# Altium project DrumPad.PrjPcb
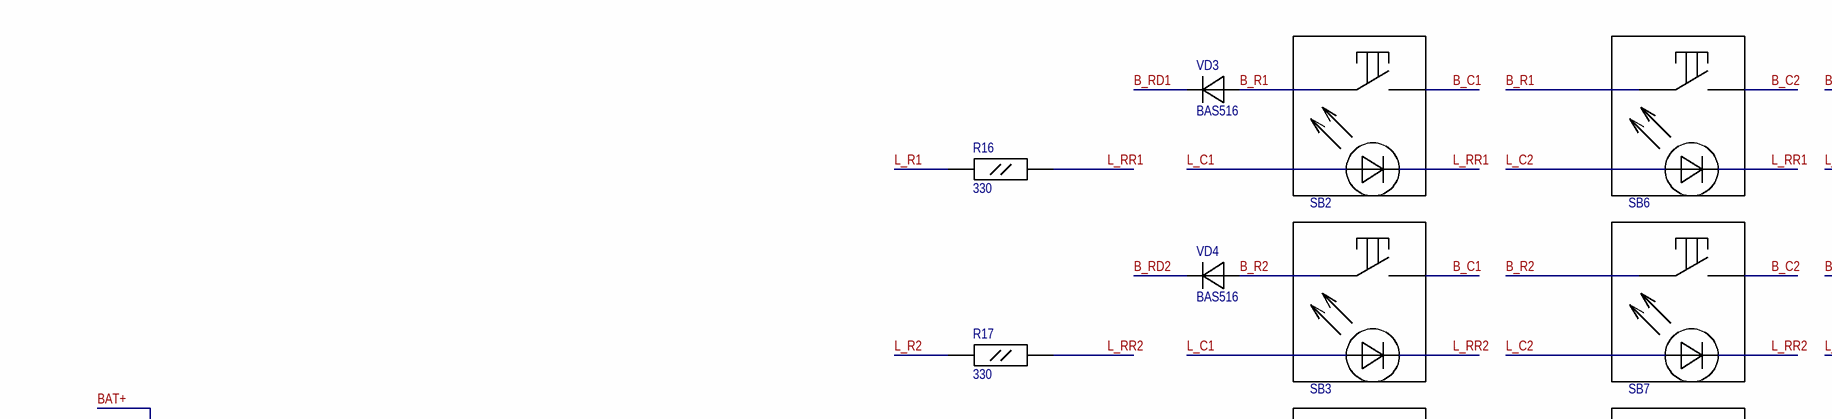
[diagram p0: DrumPad.SchDoc, top left]
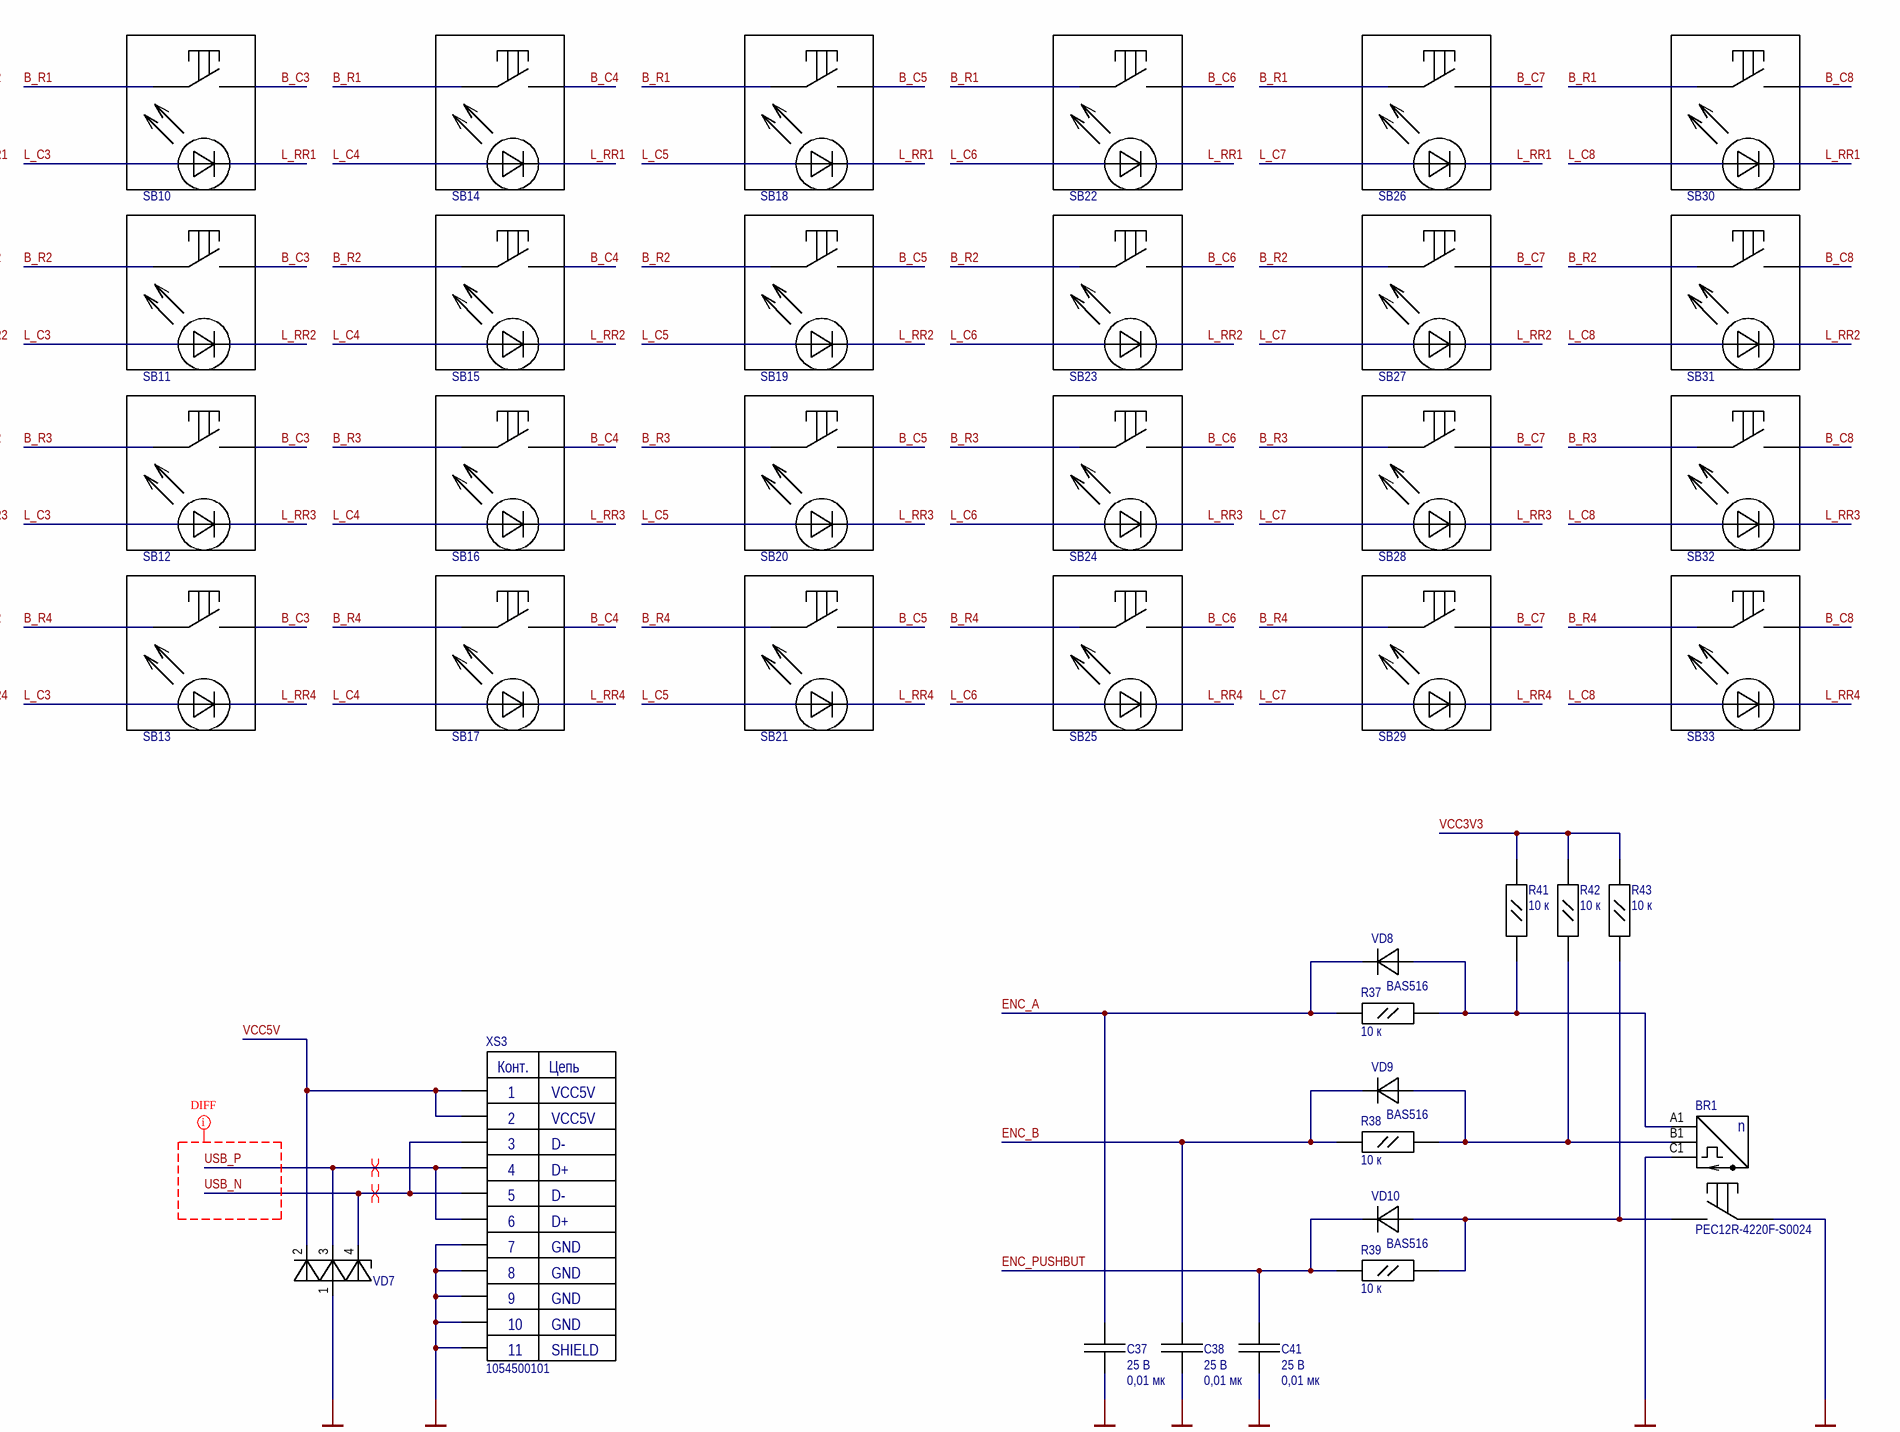
[diagram p1: DrumPad.SchDoc, top right]
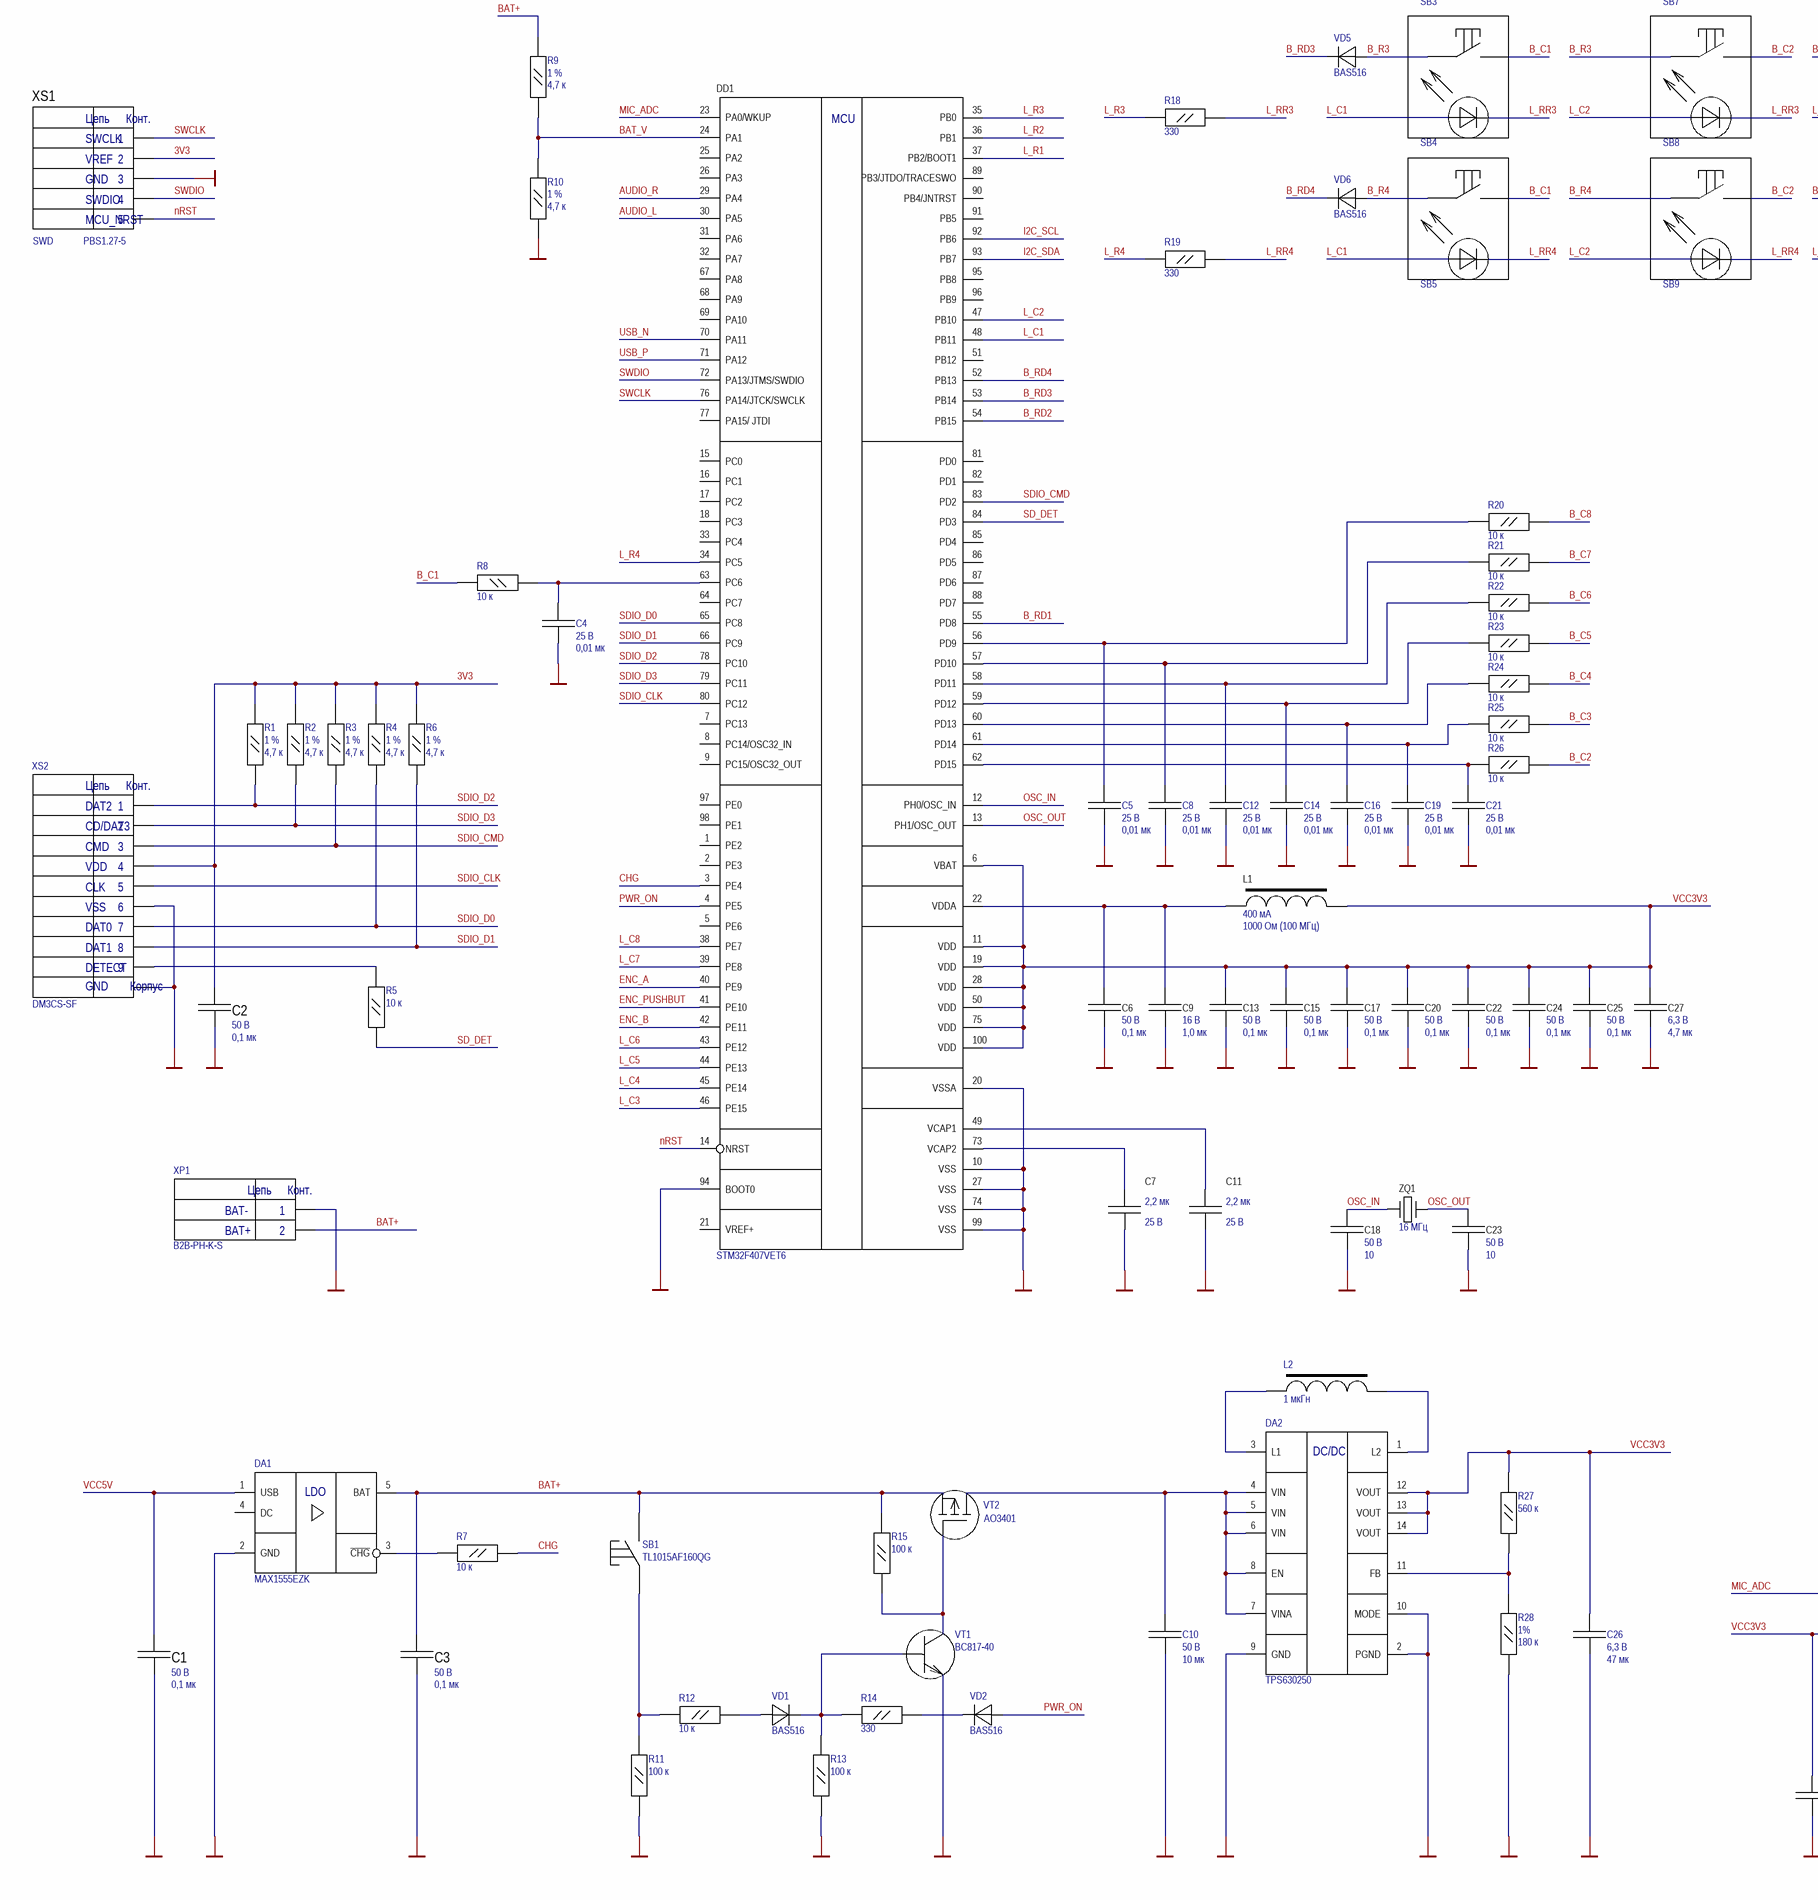
[diagram p2: DrumPad.SchDoc, bottom left]
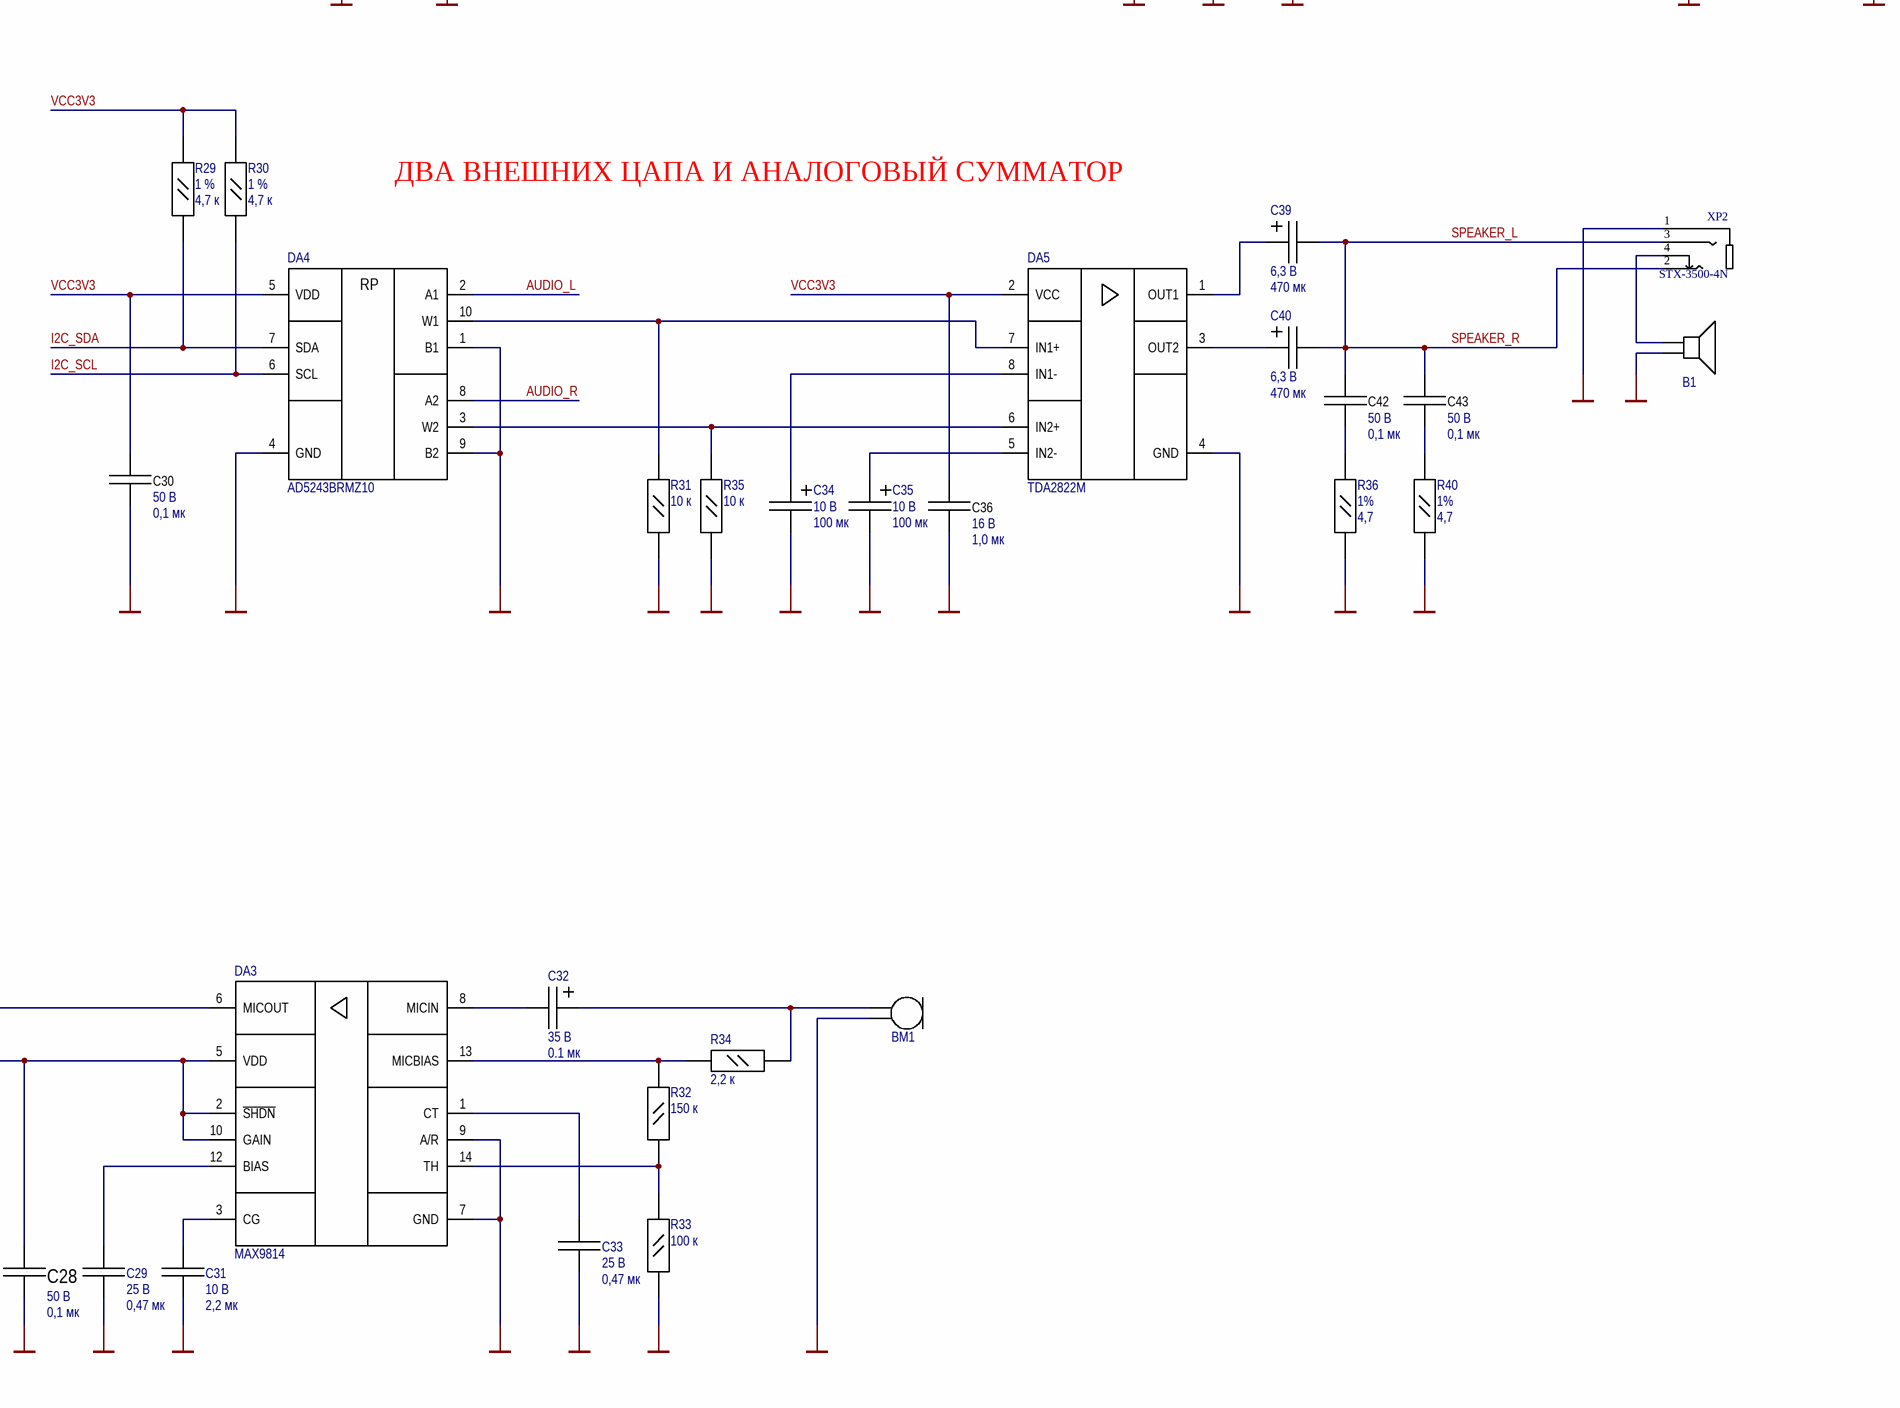
[diagram p3: DrumPad.SchDoc, bottom right]
Document Number: DP.01; DocumentNumber: DP.01; Name: ДАНЯ; Title doc: Drum Pad; Проверил: Никто(; Разработал: Я; Утвердил: Никто(
1 sheet, 148 parts. Net scope: global (net labels, ports and power ports of the same name join across sheets).
Board file: DrumPad.PcbDoc

## Sheet DrumPad.SchDoc: =Title doc
size 840 x 594 mm; ApprovedBy: Никто(; CheckedBy: Никто(; DrawnBy: Я; Organization: ДАНЯ; Address1: L3, 12a Rodborough Rd; Address2: Frenchs Forest; Address3: NSW; Address4: Australia 2086; DocumentNumber: DP.01

### Parts
B1  Speaker  [Speaker 20mm]  (value not drawn)
BM1  EM-9767  [EM-9767]  (value not drawn)
BR1  PEC12R-4220F-S0024  [PEC12R4220FS0024]
C1  value 0,1 мк  Rated voltage: 50 В  [C_0603_Manual_mount]  (hidden comment: CC0603KRX7R9BB104)
C2  value 0,1 мк  Rated voltage: 50 В  [C_0603_Manual_mount]  (hidden comment: CC0603KRX7R9BB104)
C3  value 0,1 мк  Rated voltage: 50 В  [C_0603_Manual_mount]  (hidden comment: CC0603KRX7R9BB104)
C4  value 0,01 мк  Rated voltage: 25 В  [C_0603_Manual_mount]  (hidden comment: CC0603KRX7R8BB103)
C5  value 0,01 мк  Rated voltage: 25 В  [C_0603_Manual_mount]  (hidden comment: CC0603KRX7R8BB103)
C6  value 0,1 мк  Rated voltage: 50 В  [C_0603_Manual_mount]  (hidden comment: CC0603KRX7R9BB104)
C7  value 2,2 мк  Rated voltage: 25 В  [C_0603_Manual_mount]  (hidden comment: GRM188R61E225KA12)
C8  value 0,01 мк  Rated voltage: 25 В  [C_0603_Manual_mount]  (hidden comment: CC0603KRX7R8BB103)
C9  value 1,0 мк  Rated voltage: 16 В  [C_0603_Manual_mount]  (hidden comment: GRM188R61C105KA93)
C10  value 10 мк  Rated voltage: 50 В  [C_1210_Manual_mount]  (hidden comment: GRM32ER61H106MA12)
C11  value 2,2 мк  Rated voltage: 25 В  [C_0603_Manual_mount]  (hidden comment: GRM188R61E225KA12)
C12  value 0,01 мк  Rated voltage: 25 В  [C_0603_Manual_mount]  (hidden comment: CC0603KRX7R8BB103)
C13  value 0,1 мк  Rated voltage: 50 В  [C_0603_Manual_mount]  (hidden comment: CC0603KRX7R9BB104)
C14  value 0,01 мк  Rated voltage: 25 В  [C_0603_Manual_mount]  (hidden comment: CC0603KRX7R8BB103)
C15  value 0,1 мк  Rated voltage: 50 В  [C_0603_Manual_mount]  (hidden comment: CC0603KRX7R9BB104)
C16  value 0,01 мк  Rated voltage: 25 В  [C_0603_Manual_mount]  (hidden comment: CC0603KRX7R8BB103)
C17  value 0,1 мк  Rated voltage: 50 В  [C_0603_Manual_mount]  (hidden comment: CC0603KRX7R9BB104)
C18  value 10  Rated voltage: 50 В  [C_0603_Manual_mount]  (hidden comment: GRM1885C1H100JA01)
C19  value 0,01 мк  Rated voltage: 25 В  [C_0603_Manual_mount]  (hidden comment: CC0603KRX7R8BB103)
C20  value 0,1 мк  Rated voltage: 50 В  [C_0603_Manual_mount]  (hidden comment: CC0603KRX7R9BB104)
C21  value 0,01 мк  Rated voltage: 25 В  [C_0603_Manual_mount]  (hidden comment: CC0603KRX7R8BB103)
C22  value 0,1 мк  Rated voltage: 50 В  [C_0603_Manual_mount]  (hidden comment: CC0603KRX7R9BB104)
C23  value 10  Rated voltage: 50 В  [C_0603_Manual_mount]  (hidden comment: GRM1885C1H100JA01)
C24  value 0,1 мк  Rated voltage: 50 В  [C_0603_Manual_mount]  (hidden comment: CC0603KRX7R9BB104)
C25  value 0,1 мк  Rated voltage: 50 В  [C_0603_Manual_mount]  (hidden comment: CC0603KRX7R9BB104)
C26  value 47 мк  Rated voltage: 6,3 В  [C_1210_Manual_mount]  (hidden comment: CC1210KRX5R5BB476)
C27  value 4,7 мк  Rated voltage: 6,3 В  [C_0603_Manual_mount]  (hidden comment: CC0603KRX5R5BB475)
C28  value 0,1 мк  Rated voltage: 50 В  [C_0603_Manual_mount]  (hidden comment: CC0603KRX7R9BB104)
C29  value 0,47 мк  Rated voltage: 25 В  [C_0603_Auto_mount]  (hidden comment: CC0603KRX5R8BB474)
C30  value 0,1 мк  Rated voltage: 50 В  [C_0603_Manual_mount]  (hidden comment: CC0603KRX7R9BB104)
C31  value 2,2 мк  Rated voltage: 10 В  [C_0603_Auto_mount]  (hidden comment: GRM188R61A225KE34)
C32  value 0.1 мк  Rated voltage: 35 B  [CAPPM3216X180N]  (hidden comment: 293D104X9035A2TE3)
C33  value 0,47 мк  Rated voltage: 25 В  [C_0603_Auto_mount]  (hidden comment: CC0603KRX5R8BB474)
C34  value 100 мк  Rated voltage: 10 В  [C_Tan_C_Manual_mount]  (hidden comment: TR3C107K010C0100)
C35  value 100 мк  Rated voltage: 10 В  [C_Tan_C_Manual_mount]  (hidden comment: TR3C107K010C0100)
C36  value 1,0 мк  Rated voltage: 16 В  [C_0603_Manual_mount]  (hidden comment: GRM188R61C105KA93)
C37  value 0,01 мк  Rated voltage: 25 В  [C_0603_Manual_mount]  (hidden comment: CC0603KRX7R8BB103)
C38  value 0,01 мк  Rated voltage: 25 В  [C_0603_Manual_mount]  (hidden comment: CC0603KRX7R8BB103)
C39  value 470 мк  Rated voltage: 6,3 B  [T495D]  (hidden comment: T495D477K006ATE100)
C40  value 470 мк  Rated voltage: 6,3 B  [T495D]  (hidden comment: T495D477K006ATE100)
C41  value 0,01 мк  Rated voltage: 25 В  [C_0603_Manual_mount]  (hidden comment: CC0603KRX7R8BB103)
C42  value 0,1 мк  Rated voltage: 50 В  [C_0603_Manual_mount]  (hidden comment: CC0603KRX7R9BB104)
C43  value 0,1 мк  Rated voltage: 50 В  [C_0603_Manual_mount]  (hidden comment: CC0603KRX7R9BB104)
DA1  MAX1555EZK  [SOT-23-5]
DA2  TPS630250  [VQFN-14]
DA3  MAX9814  [TDFN-14-EP]
DA4  AD5243BRMZ10  [MSOP-10]
DA5  TDA2822M  [SO-8]
DD1  STM32F407VET6  [LQFP-100]
L1  value 1000 Ом (100 МГц)  Rated current: 400 мА  [FB_0603_Auto_mount]  (hidden comment: BLM18AG102SN1)
L2  value 1 мкГн  [SRR4028]  (hidden comment: SPM4020T-1R0M-LR)
R1  value 4,7 к  Tolerance: 1 %  [R_0603_Manual_mount]  (hidden comment: RC0603FR-074K7L)
R2  value 4,7 к  Tolerance: 1 %  [R_0603_Manual_mount]  (hidden comment: RC0603FR-074K7L)
R3  value 4,7 к  Tolerance: 1 %  [R_0603_Manual_mount]  (hidden comment: RC0603FR-074K7L)
R4  value 4,7 к  Tolerance: 1 %  [R_0603_Manual_mount]  (hidden comment: RC0603FR-074K7L)
R5  value 10 к  [R_0603_Manual_mount]  (hidden comment: RC0603JR-0710KL)
R6  value 4,7 к  Tolerance: 1 %  [R_0603_Manual_mount]  (hidden comment: RC0603FR-074K7L)
R7  value 10 к  [R_0603_Manual_mount]  (hidden comment: RC0603JR-0710KL)
R8  value 10 к  [R_0603_Manual_mount]  (hidden comment: RC0603JR-0710KL)
R9  value 4,7 к  Tolerance: 1 %  [R_0603_Manual_mount]  (hidden comment: RC0603FR-074K7L)
R10  value 4,7 к  Tolerance: 1 %  [R_0603_Manual_mount]  (hidden comment: RC0603FR-074K7L)
R11  value 100 к  [R_0603_Manual_mount]  (hidden comment: RC0603JR-07100KL)
R12  value 10 к  [R_0603_Manual_mount]  (hidden comment: RC0603JR-0710KL)
R13  value 100 к  [R_0603_Manual_mount]  (hidden comment: RC0603JR-07100KL)
R14  value 330  [R_0603_Manual_mount]  (hidden comment: RC0603JR-07330RL)
R15  value 100 к  [R_0603_Manual_mount]  (hidden comment: RC0603JR-07100KL)
R16  value 330  [R_0603_Manual_mount]  (hidden comment: RC0603JR-07330RL)
R17  value 330  [R_0603_Manual_mount]  (hidden comment: RC0603JR-07330RL)
R18  value 330  [R_0603_Manual_mount]  (hidden comment: RC0603JR-07330RL)
R19  value 330  [R_0603_Manual_mount]  (hidden comment: RC0603JR-07330RL)
R20  value 10 к  [R_0603_Manual_mount]  (hidden comment: RC0603JR-0710KL)
R21  value 10 к  [R_0603_Manual_mount]  (hidden comment: RC0603JR-0710KL)
R22  value 10 к  [R_0603_Manual_mount]  (hidden comment: RC0603JR-0710KL)
R23  value 10 к  [R_0603_Manual_mount]  (hidden comment: RC0603JR-0710KL)
R24  value 10 к  [R_0603_Manual_mount]  (hidden comment: RC0603JR-0710KL)
R25  value 10 к  [R_0603_Manual_mount]  (hidden comment: RC0603JR-0710KL)
R26  value 10 к  [R_0603_Manual_mount]  (hidden comment: RC0603JR-0710KL)
R27  value 560 к  [R_0603_Auto_mount]  (hidden comment: RC0603JR-07560KL)
R28  value 180 к  Tolerance: 1%  [R_0603_Auto_mount]  (hidden comment: RC0603FR-07180KL)
R29  value 4,7 к  Tolerance: 1 %  [R_0603_Manual_mount]  (hidden comment: RC0603FR-074K7L)
R30  value 4,7 к  Tolerance: 1 %  [R_0603_Manual_mount]  (hidden comment: RC0603FR-074K7L)
R31  value 10 к  [R_0603_Manual_mount]  (hidden comment: RC0603JR-0710KL)
R32  value 150 к  [R_0603_Manual_mount]  (hidden comment: RC0603JR-07150KL)
R33  value 100 к  [R_0603_Auto_mount]  (hidden comment: RC0603JR-07100KL)
R34  value 2,2 к  [R_0603_Manual_mount]  (hidden comment: RC0603JR-072K2L)
R35  value 10 к  [R_0603_Manual_mount]  (hidden comment: RC0603JR-0710KL)
R36  value 4,7  Tolerance: 1%  [R_0603_Manual_mount]  (hidden comment: RC0603FR-074R7L)
R37  value 10 к  [R_0603_Manual_mount]  (hidden comment: RC0603JR-0710KL)
R38  value 10 к  [R_0603_Manual_mount]  (hidden comment: RC0603JR-0710KL)
R39  value 10 к  [R_0603_Manual_mount]  (hidden comment: RC0603JR-0710KL)
R40  value 4,7  Tolerance: 1%  [R_0603_Manual_mount]  (hidden comment: RC0603FR-074R7L)
R41  value 10 к  [R_0603_Manual_mount]  (hidden comment: RC0603JR-0710KL)
R42  value 10 к  [R_0603_Manual_mount]  (hidden comment: RC0603JR-0710KL)
R43  value 10 к  [R_0603_Manual_mount]  (hidden comment: RC0603JR-0710KL)
SB1  TL1015AF160QG  [TL1015AF160QG]
SB2  Led_button  [Led_button]  (value not drawn)
SB3  Led_button  [Led_button]  (value not drawn)
SB4  Led_button  [Led_button]  (value not drawn)
SB5  Led_button  [Led_button]  (value not drawn)
SB6  Led_button  [Led_button]  (value not drawn)
SB7  Led_button  [Led_button]  (value not drawn)
SB8  Led_button  [Led_button]  (value not drawn)
SB9  Led_button  [Led_button]  (value not drawn)
SB10  Led_button  [Led_button]  (value not drawn)
SB11  Led_button  [Led_button]  (value not drawn)
SB12  Led_button  [Led_button]  (value not drawn)
SB13  Led_button  [Led_button]  (value not drawn)
SB14  Led_button  [Led_button]  (value not drawn)
SB15  Led_button  [Led_button]  (value not drawn)
SB16  Led_button  [Led_button]  (value not drawn)
SB17  Led_button  [Led_button]  (value not drawn)
SB18  Led_button  [Led_button]  (value not drawn)
SB19  Led_button  [Led_button]  (value not drawn)
SB20  Led_button  [Led_button]  (value not drawn)
SB21  Led_button  [Led_button]  (value not drawn)
SB22  Led_button  [Led_button]  (value not drawn)
SB23  Led_button  [Led_button]  (value not drawn)
SB24  Led_button  [Led_button]  (value not drawn)
SB25  Led_button  [Led_button]  (value not drawn)
SB26  Led_button  [Led_button]  (value not drawn)
SB27  Led_button  [Led_button]  (value not drawn)
SB28  Led_button  [Led_button]  (value not drawn)
SB29  Led_button  [Led_button]  (value not drawn)
SB30  Led_button  [Led_button]  (value not drawn)
SB31  Led_button  [Led_button]  (value not drawn)
SB32  Led_button  [Led_button]  (value not drawn)
SB33  Led_button  [Led_button]  (value not drawn)
VD1  BAS516  [SOD-523]
VD2  BAS516  [SOD-523]
VD3  BAS516  [SOD-523]
VD4  BAS516  [SOD-523]
VD5  BAS516  [SOD-523]
VD6  BAS516  [SOD-523]
VD7  SP0503BAHTG  [SOT-143-4]  (value not drawn)
VD8  BAS516  [SOD-523]
VD9  BAS516  [SOD-523]
VD10  BAS516  [SOD-523]
VT1  BC817-40  [SOT-23]
VT2  AO3401  [SOT-23]
XP1  B2B-PH-K-S  [B2B-PH-K-S]
XP2  STX-3500-4N  [KYCON_STX-3500-4N]
XS1  PBS1.27-5  Interface: SWD  [PBS1.27-5]
XS2  DM3CS-SF  [DM3CSSF]
XS3  1054500101  [MOLEX_1054500101]
ZQ1  value 16 МГц  [NX3225SA]  (hidden comment: NX3225SA-16.000M-STD-CRS-2)

### Nets
GND: B1.1 BM1.2 BR1.1 BR1.C1 C1.2 C2.2 C3.2 C4.2 C5.2 C6.2 C7.2 C8.2 C9.2 C10.2 C11.2 C12.2 C13.2 C14.2 C15.2 C16.2 C17.2 C18.2 C19.2 C20.2 C21.2 C22.2 C23.2 C24.2 C25.2 C26.2 C27.2 C28.2 C29.2 C30.2 C31.2 C33.2 C34.2 C35.2 C36.2 C37.2 C38.2 C41.2 DA1.2(GND) DA2.2(PGND) DA2.9(GND) DA2.10(MODE) DA3.7(GND) DA3.9(A/R) DA4.1(B1) DA4.4(GND) DA4.9(B2) DA5.4(GND) DD1.10(VSS) DD1.20(VSSA) DD1.27(VSS) DD1.74(VSS) DD1.94(BOOT0) DD1.99(VSS) R10.1 R11.1 R13.1 R28.1 R31.2 R33.1 R35.2 R36.1 R40.1 VD7.1 VT1.2(E) XP1.1 XP2.1 XS1.3 XS2.0 XS2.6 XS3.A1(GND) XS3.A12(GND) XS3.B1(GND) XS3.B12(GND) XS3.SHIELD
3V3: C2.1 R1.2 R2.2 R3.2 R4.2 R6.2 XS1.2 XS2.4
AUDIO_L: DA4.2(A1) DD1.30(PA5)
AUDIO_R: DA4.8(A2) DD1.29(PA4)
B_C1: R8.1 SB2.2 SB3.2 SB4.2 SB5.2
B_C2: R26.1 SB6.2 SB7.2 SB8.2 SB9.2
B_C3: R25.1 SB10.2 SB11.2 SB12.2 SB13.2
B_C4: R24.1 SB14.2 SB15.2 SB16.2 SB17.2
B_C5: R23.1 SB18.2 SB19.2 SB20.2 SB21.2
B_C6: R22.1 SB22.2 SB23.2 SB24.2 SB25.2
B_C7: R21.1 SB26.2 SB27.2 SB28.2 SB29.2
B_C8: R20.1 SB30.2 SB31.2 SB32.2 SB33.2
B_R1: SB2.1 SB6.1 SB10.1 SB14.1 SB18.1 SB22.1 SB26.1 SB30.1 VD3.A
B_R2: SB3.1 SB7.1 SB11.1 SB15.1 SB19.1 SB23.1 SB27.1 SB31.1 VD4.A
B_R3: SB4.1 SB8.1 SB12.1 SB16.1 SB20.1 SB24.1 SB28.1 SB32.1 VD5.A
B_R4: SB5.1 SB9.1 SB13.1 SB17.1 SB21.1 SB25.1 SB29.1 SB33.1 VD6.A
B_RD1: DD1.55(PD8) VD3.C
B_RD2: DD1.54(PB15) VD4.C
B_RD3: DD1.53(PB14) VD5.C
B_RD4: DD1.52(PB13) VD6.C
BAT+: C3.1 DA1.5(BAT) R9.2 R15.2 SB1.2 VT2.2 XP1.2
BAT_V: DD1.24(PA1) R9.1 R10.2
CHG: DD1.3(PE4) R7.1
ENC_A: C37.1 DD1.40(PE9) R37.1 VD8.C
ENC_B: C38.1 DD1.42(PE11) R38.1 VD9.C
ENC_PUSHBUT: C41.1 DD1.41(PE10) R39.1 VD10.C
I2C_SCL: DA4.6(SCL) DD1.92(PB6) R30.1
I2C_SDA: DA4.7(SDA) DD1.93(PB7) R29.1
L_C1: DD1.48(PB11) SB2.3 SB3.3 SB4.3 SB5.3
L_C2: DD1.47(PB10) SB6.3 SB7.3 SB8.3 SB9.3
L_C3: DD1.46(PE15) SB10.3 SB11.3 SB12.3 SB13.3
L_C4: DD1.45(PE14) SB14.3 SB15.3 SB16.3 SB17.3
L_C5: DD1.44(PE13) SB18.3 SB19.3 SB20.3 SB21.3
L_C6: DD1.43(PE12) SB22.3 SB23.3 SB24.3 SB25.3
L_C7: DD1.39(PE8) SB26.3 SB27.3 SB28.3 SB29.3
L_C8: DD1.38(PE7) SB30.3 SB31.3 SB32.3 SB33.3
L_R1: DD1.37(PB2/BOOT1) R16.1
L_R2: DD1.36(PB1) R17.1
L_R3: DD1.35(PB0) R18.1
L_R4: DD1.34(PC5) R19.1
L_RR1: R16.2 SB2.4 SB6.4 SB10.4 SB14.4 SB18.4 SB22.4 SB26.4 SB30.4
L_RR2: R17.2 SB3.4 SB7.4 SB11.4 SB15.4 SB19.4 SB23.4 SB27.4 SB31.4
L_RR3: R18.2 SB4.4 SB8.4 SB12.4 SB16.4 SB20.4 SB24.4 SB28.4 SB32.4
L_RR4: R19.2 SB5.4 SB9.4 SB13.4 SB17.4 SB21.4 SB25.4 SB29.4 SB33.4
MIC_ADC: DA3.6(MICOUT) DD1.23(PA0/WKUP)
nRST: DD1.14(NRST) XS1.5
OSC_IN: C18.1 DD1.12(PH0/OSC_IN) ZQ1.3(XO)
OSC_OUT: C23.1 DD1.13(PH1/OSC_OUT) ZQ1.1(XI)
PWR_ON: DD1.4(PE5) VD2.A
SD_DET: DD1.84(PD3) R5.1
SDIO_CLK: DD1.80(PC12) XS2.5
SDIO_CMD: DD1.83(PD2) R3.1 XS2.3
SDIO_D0: DD1.65(PC8) R4.1 XS2.7
SDIO_D1: DD1.66(PC9) R6.1 XS2.8
SDIO_D2: DD1.78(PC10) R1.1 XS2.1
SDIO_D3: DD1.79(PC11) R2.1 XS2.2
SPEAKER_L: C39.2 C40.2 C42.1 C43.1 XP2.2 XP2.3  [also labelled SPEAKER_R]
SWCLK: DD1.76(PA14/JTCK/SWCLK) XS1.1
SWDIO: DD1.72(PA13/JTMS/SWDIO) XS1.4
USB_N: DD1.70(PA11) VD7.4 XS3.A7(D-) XS3.B7(D-)
USB_P: DD1.71(PA12) VD7.3 XS3.A6(D+) XS3.B6(D+)
VCC3V3: C13.1 C15.1 C17.1 C20.1 C22.1 C24.1 C25.1 C26.1 C27.1 C28.1 C30.1 C36.1 DA2.12(VOUT) DA2.13(VOUT) DA2.14(VOUT) DA3.2(~{SHDN}) DA3.5(VDD) DA3.10(GAIN) DA4.5(VDD) DA5.2(VCC) DD1.6(VBAT) DD1.11(VDD) DD1.19(VDD) DD1.28(VDD) DD1.50(VDD) DD1.75(VDD) DD1.100(VDD) L1.2 R27.2 R29.2 R30.2 R41.1 R42.1 R43.1
VCC5V: C1.1 DA1.1(USB) VD7.2 XS3.A5(CC1) XS3.B5(CC2)
NetB1_2: B1.2 XP2.4
NetBM1_1: BM1.1 C32.1 R34.2
NetBR1_2: BR1.2 R39.2 R43.2 VD10.A
NetBR1_A1: BR1.A1 R37.2 R41.2 VD8.A
NetBR1_B1: BR1.B1 R38.2 R42.2 VD9.A
NetC4_1: C4.1 DD1.63(PC6) R8.2
NetC5_1: C5.1 DD1.56(PD9) R20.2
NetC6_1: C6.1 C9.1 DD1.22(VDDA) L1.1
NetC7_1: C7.1 DD1.73(VCAP2)
NetC8_1: C8.1 DD1.57(PD10) R21.2
NetC10_1: C10.1 DA2.4(VIN) DA2.5(VIN) DA2.6(VIN) DA2.7(VINA) DA2.8(EN) VT2.3
NetC11_1: C11.1 DD1.49(VCAP1)
NetC12_1: C12.1 DD1.58(PD11) R22.2
NetC14_1: C14.1 DD1.59(PD12) R23.2
NetC16_1: C16.1 DD1.60(PD13) R24.2
NetC19_1: C19.1 DD1.61(PD14) R25.2
NetC21_1: C21.1 DD1.62(PD15) R26.2
NetC29_1: C29.1 DA3.12(BIAS)
NetC31_1: C31.1 DA3.3(CG)
NetC32_2: C32.2 DA3.8(MICIN)
NetC33_1: C33.1 DA3.1(CT)
NetC34_1: C34.1 DA5.8(IN1-)
NetC35_1: C35.1 DA5.5(IN2-)
NetC39_1: C39.1 DA5.1(OUT1)
NetC40_1: C40.1 DA5.3(OUT2)
NetC42_2: C42.2 R36.2
NetC43_2: C43.2 R40.2
NetDA1_3: DA1.3(~{CHG}) R7.2
NetDA2_1: DA2.1(L2) L2.2
NetDA2_3: DA2.3(L1) L2.1
NetDA2_11: DA2.11(FB) R27.1 R28.2
NetDA3_13: DA3.13(MICBIAS) R32.1 R34.1
NetDA3_14: DA3.14(TH) R32.2 R33.2
NetDA4_3: DA4.3(W2) DA5.6(IN2+) R35.1
NetDA4_10: DA4.10(W1) DA5.7(IN1+) R31.1
NetR5_2: R5.2 XS2.9
NetR11_2: R11.2 R12.2 SB1.1
NetR12_1: R12.1 VD1.A
NetR13_2: R13.2 R14.1 VD1.C VT1.1(B)
NetR14_2: R14.2 VD2.C
NetR15_1: R15.1 VT1.3(C) VT2.1

Not connected (* = marked no-connect by the designer): DA1 4(DC); DD1 1(PE2) 2(PE3) 5(PE6) 7(PC13) 8(PC14/OSC32_IN) 9(PC15/OSC32_OUT) 15(PC0) 16(PC1) 17(PC2) 18(PC3) 21(VREF+) 25(PA2) 26(PA3) 31(PA6) 32(PA7) 33(PC4) 51(PB12) 64(PC7) 67(PA8) 68(PA9) 69(PA10) 77(PA15/_JTDI) 81(PD0) 82(PD1) 85(PD4) 86(PD5) 87(PD6) 88(PD7) 89(PB3/JTDO/TRACESWO) 90(PB4/JNTRST) 91(PB5) 95(PB8) 96(PB9) 97(PE0) 98(PE1); ZQ1 2(NC) 4(NC)

### Layout directives
differential pair: USB_N, USB_P
net class DIFF: USB_N, USB_P

### Notes on the sheet
- ДВА ВНЕШНИХ ЦАПА И АНАЛОГОВЫЙ СУММАТОР
- BAT-
- BAT+
- Перв. примен.
- Справ. №
- Подп. и дата
- Инв. № дубл.
- Взам. инв. №
- Изм.
- Лист
- № докум.
- Подп.
- Дата
- Лит.
- Масса
- Масштаб
- Т.контр.
- Пров.
- Разраб.
- Листов
- Инв. № подл.
- Н.контр.
- Утв.
- Копировал
- Формат А1
- (in symbol 1054500101) Конт.; Цепь; 1; VCC5V; 2; 3; 4; 5; 6; 7; 8; 9; 10; 11
- (in symbol AD5243BRMZ10) RP
- (in symbol B2B-PH-K-S) Цепь; Конт.
- (in symbol DM3CS-SF) Цепь; Конт.; DAT2; CD/DAT3; CMD; VDD; CLK; VSS; DAT0; DAT1; DETECT; GND; Корпус
- (in symbol MAX1555EZK) LDO
- (in symbol PEC12R-4220F-S0024) n
- (in symbol STM32F407VET6) MCU
- (in symbol SWD PBS1.27-5) Цепь; Конт.; SWCLK; VREF; GND; SWDIO; MCU_NRST
- (in symbol TPS630250) DC/DC

### Library data of the parts
B1 = Speaker: Динамик
BM1 = EM-9767: Микрофон; Resistance: 2,2 кОм; Voltage: 4,5 В
BR1 = PEC12R-4220F-S0024: Encoder; Manufacturer: /Укажите компанию-производителя/; Num of pulses: 24; Type: Энкодер инкрементальный; Num of detends: 24
C1-C3 C6 C13 C15 C17 C20 C22 C24 C25 C28 C30 C42 C43 = CC0603KRX7R9BB104: Surface-mount Ceramic Multilayer Capacitor; Manufacturer: YAGEO; Tolerance: 10 %; Temperature coefficient: ±15 %; Type: Конденсатор керамический; TC: X7R; Size: 0603; Temperature range: -55 ... 125 °C
C4 C5 C8 C12 C14 C16 C19 C21 C37 C38 C41 = CC0603KRX7R8BB103: Surface-mount Ceramic Multilayer Capacitor; Manufacturer: YAGEO; Tolerance: 10 %; Temperature coefficient: ±15 %; Type: Конденсатор керамический; TC: X7R; Size: 0603; Temperature range: -55 ... 125 °C
C7 C11 = GRM188R61E225KA12: Chip Monolithic Ceramic Capacitor; Manufacturer: Murata Manufacturing; Tolerance: 0,1; Temperature coefficient: ±15 %; Type: Конденсатор керамический; TC: X5R; Size: 0603; Temperature range: -55 ... 85 °C
C9 C36 = GRM188R61C105KA93: Chip Monolithic Ceramic Capacitor; Manufacturer: Murata Manufacturing; Tolerance: 0,1; Temperature coefficient: ±15 %; Type: Конденсатор керамический; TC: X5R; Size: 0603; Temperature range: -55 ... 85 °C
C10 = GRM32ER61H106MA12: Chip Monolithic Ceramic Capacitor; Manufacturer: Murata Manufacturing; Tolerance: 0,2; Temperature coefficient: ±15 %; Type: Конденсатор керамический; TC: X5R; Size: 1210; Temperature range: -55 ... 85 °C
C18 C23 = GRM1885C1H100JA01: Chip Monolithic Ceramic Capacitor; Manufacturer: Murata Manufacturing; Tolerance: 0,05; Temperature coefficient: ±30 ppm/°C; Type: Конденсатор керамический; TC: C0G; Size: 0603; Temperature range: -55 ... 125 °C
C26 = CC1210KRX5R5BB476: Surface-mount Ceramic Multilayer Capacitor; Manufacturer: YAGEO; Tolerance: 10 %; Temperature coefficient: ±15 %; Type: Конденсатор керамический; TC: X5R; Size: 1210; Temperature range: -55 ... 85 °C
C27 = CC0603KRX5R5BB475: Surface-mount Ceramic Multilayer Capacitor; Manufacturer: YAGEO; Tolerance: 10 %; Temperature coefficient: ±15 %; Type: Конденсатор керамический; TC: X5R; Size: 0603; Temperature range: -55 ... 85 °C
C29 C33 = CC0603KRX5R8BB474: Surface-mount Ceramic Multilayer Capacitor; Manufacturer: YAGEO; Tolerance: 10 %; Temperature coefficient: ±15 %; Type: Конденсатор керамический; TC: X5R; Size: 0603; Temperature range: -55 ... 85 °C
C31 = GRM188R61A225KE34: Chip Monolithic Ceramic Capacitor; Manufacturer: Murata Manufacturing; Tolerance: 0,1; Temperature coefficient: ±15 %; Type: Конденсатор керамический; TC: X5R; Size: 0603; Temperature range: -55 ... 85 °C
C32 = 293D104X9035A2TE3: Tantal Capacitor; Manufacturer: VISHAY; Tolerance: 10%; Type: Конденсатор танталовый; Size: 3,2 X 1,6 X 1,6 mm; Temperature range: -55 ... 125 °C
C34 C35 = TR3C107K010C0100: Solid Tantalum Surface Mount Chip Capacitor, TANTAMOUNT, Molded Case, Low ESR; Manufacturer: VISHAY; Tolerance: 10%; Type: Конденсатор танталовый; ESR: 100 мОм; Size: C; Temperature range: -55 ... 85 °C
C39 C40 = T495D477K006ATE100: Tantal Capacitor; Manufacturer: KEMET; Tolerance: 10%; Type: Конденсатор танталовый; Size: 7.3 X 4.3 X 2.8mm; Temperature range: -55 ... 125 °C
DA1 = MAX1555EZK: 1S Li-Po/Li-Ion charger; Manufacturer: maxim integrated; Input voltage: 3,7 ... 7 В; Output current: DC280/USB90; Battery type: Li-Ion/Li-Poly; Number of cells: 1; Type: Контроллер АКБ; Temperature range: -40 ... 85 °C
DA2 = TPS630250: High efficiency, low quiescent current buck-boost converter; Manufacturer: TI; Output voltage: 3,3 В; Input voltage: 2,3 ... 5,5 В; Type: Импульсный преобразователь напряжения с гальванической развязкой; Temperature range: -40 ... 85°C
DA3 = MAX9814: Microphone audio power amplifier; Manufacturer: Maxim; Supply voltage: 2.7 В ... 5.5 В; Maximum Gain: 40 дБ; Temperature range: -40 ... 150 °C
DA4 = AD5243BRMZ10: 2-channel, 256-position potentiometers; Manufacturer: Analog Devices; Supply voltage: 2.7... 5.5 В; Output current: 1 А; End-to-end resistance: 10 кОм; Type: Цифровой потенциометр; Temperature range: -40 ... 125 °C
DA5 = TDA2822M: Dual audio power amplifier; Manufacturer: ST; Output current: 1 А; Supply voltage: 1,8 В ... 15 В; Temperature range: -40 ... 150 °C
DD1 = STM32F407VET6: ARM Cortex-M4 32b MCU+FPU, 210DMIPS, up to 1MB Flash/192+4KB RAM,  crypto, USB OTG HS/FS, Ethernet, 17 TIMs, 3 ADCs, 15 comm. interfaces & camera; Manufacturer: STMicroelectronics; Flash: 1024 кбайт; SRAM: 192+4 кбайт; Timers: 10+2+2; RTC: Есть; SPI/I2S: 3/2; I2C: 3; USART/UART: 4/2; CAN: 2; Ethernet: Нет; ADC resolution: 12 бит; ADC channels: 16; CPU frequency: 168 МГц; Supply voltage: 1,8 ... 3,6 В; Type: Микроконтроллер; Processor architecture: ARM Cortex-M4; USB OTG FS: Есть; USB OTG HS: Есть; SDIO: Есть; Camera interface: Нет; Cryptography: Есть; ADC: 3; DAC resolution: 12 бит; DAC: 2; Temperature range: -40 ... 85 °C; FSMC: Есть; Random number generator: Есть; FPU: Есть; DSP: Есть; DMA: Есть; MPU: Есть
L1 = BLM18AG102SN1: Chip Ferrite Bead; Manufacturer: Murata Manufacturing; Tolerance: 25%; DC resistance: 500 мОм; Type: Ферритовая бусина; Size: 0603; Temperature range: -55 ... 125 °C
L2 = SPM4020T-1R0M-LR: Shielded Power Inductor; Manufacturer: TDK; Tolerance: 20%; DC resistance: 28мОм; Type: Индуктивность силовая; Test frequency: 100КГц; Rated current: 9 А; Saturation current: 5.6 А; Size: 4.4x4.1x2.0 мм; Temperature range: -40 ... 125°C
R1-R4 R6 R9 R10 R29 R30 = RC0603FR-074K7L: General Purpose Chip Resistor; Manufacturer: YAGEO; Power dissipation: 0,1 Вт; Temperature coefficient: ±100 ppm/°C; Size: 0603; Temperature range: -55 ... 155 °C; Type: Резистор постоянный; Part Number: RC0603FR-074K7L
R5 R7 R8 R12 R20-R26 R31 R35 R37-R39 R41-R43 = RC0603JR-0710KL: General Purpose Chip Resistor; Manufacturer: YAGEO; Tolerance: 5 %; Power dissitipation: 0,1 Вт; Temperature coefficient: ±100 ppm/°C; Size: 0603; Temperature range: -55 ... 155 °C; Type: Резистор постоянный
R11 R13 R15 R33 = RC0603JR-07100KL: General Purpose Chip Resistor; Manufacturer: YAGEO; Tolerance: 5 %; Power dissitipation: 0,1 Вт; Temperature coefficient: ±100 ppm/°C; Size: 0603; Temperature range: -55 ... 155 °C; Type: Резистор постоянный
R14 R16-R19 = RC0603JR-07330RL: General Purpose Chip Resistor; Manufacturer: YAGEO; Tolerance: 5 %; Power dissitipation: 0,1 Вт; Temperature coefficient: ±100 ppm/°C; Size: 0603; Temperature range: -55 ... 155 °C; Type: Резистор постоянный
R27 = RC0603JR-07560KL: General Purpose Chip Resistor; Manufacturer: YAGEO; Tolerance: 5 %; Power dissitipation: 0,1 Вт; Temperature coefficient: ±100 ppm/°C; Size: 0603; Temperature range: -55 ... 155 °C; Type: Резистор постоянный
R28 = RC0603FR-07180KL: General Purpose Chip Resistor; Manufacturer: YAGEO; Power dissitipation: 0,1 Вт; Temperature coefficient: ±100 ppm/°C; Size: 0603; Temperature range: -55 ... 155 °C; Type: Резистор постоянный
R32 = RC0603JR-07150KL: General Purpose Chip Resistor; Manufacturer: YAGEO; Tolerance: 5 %; Power dissitipation: 0,1 Вт; Temperature coefficient: ±100 ppm/°C; Size: 0603; Temperature range: -55 ... 155 °C; Type: Резистор постоянный
R34 = RC0603JR-072K2L: General Purpose Chip Resistor; Manufacturer: YAGEO; Tolerance: 5 %; Power dissitipation: 0,1 Вт; Temperature coefficient: ±100 ppm/°C; Size: 0603; Temperature range: -55 ... 155 °C; Type: Резистор постоянный
R36 R40 = RC0603FR-074R7L: General Purpose Chip Resistor; Manufacturer: YAGEO; Temperature coefficient: ±100 ppm/°C; Power dissitipation: 0,1 Вт; Size: 0603; Temperature range: -55 ... 155 °C; Type: Резистор постоянный
SB1 = TL1015AF160QG: SMD pushbutton; Manufacturer: E-SWITCH; Junction resistance: 100 мОм; Rated voltage: 12 В; Rated current: 50 мА; Life cycles: 50000; Type: Выключатель кнопочный с самовозвратом
SB2-SB33 = Led_button: Кнопка с встроенным светодиодом; Manufacturer: NONAME; Junction resistance: 100 мОм; Rated voltage: 12 В; Rated current: 50 мА; Life cycles: 100000; Type: Выключатель кнопочный с самовозвратом
VD1-VD6 VD8-VD10 = BAS516: High-speed switching diode; Manufacturer: NXP; Type: Диод импульсный; Max forward average current: 250 мА; Max reverse voltage: 100 В; Forward voltage: 1 В; Reverse recovery time: 4 нс; Max repetitive peak forward current: 500 мА; Max non-repetitive peak forward current: 1 А; Power dissitipation: 500 мВт; Temperature range: -65 ... 150 °C
VD7 = SP0503BAHTG: 30pF 30kV Unidirectional TVS Array; Manufacturer: Littelfuse; Type: Защитный диод; Input capacitance: 30 пФ; Clamp voltage duting ESD: 12 В; ESD protect voltage: 30 кВ; Signal clamp voltage: 7,8 В; Temperature range: -40 ... 85 °C
VT1 = BC817-40: NPN general-purpose transistor; Manufacturer: NXP; Structure: n-p-n; Type: Транзистор биполярный; hFE: 250 ... 600; Max collector-emitter voltage: 45 В; Max collector-base voltage: 50 В; Max emitter-base voltage: 5 В; Max collector current: 0,5 А; Max collector peak current: 1 А; Power dissitipation: 0,25 Вт; fT: 100 МГц; Collector-emitter saturation voltage: 0,7 В; Base-emitter on voltage: 1,2 В; Specitication: ЭКБ ИП; Collector-base сapacitance: 3 пФ; Complement: BC807-40; Temperature range: -65 ... 150 °C
VT2 = AO3401: Транзистор полевой P-канальный; Manufacturer: Hottech; Structure: Индуцированный канал p-типа; Type: Транзистор полевой с изолированным затвором; Max gate-to-source voltage: 12 В; Drain-to-source breakdown voltage: 30 В; Gate threshold voltage: 1,3 В; Max continuous drain current: 4.2 А; Max pulsed drain current: 27; Power dissitipation: 1.4 Вт; Rds: 50 мОм; Forward transconductance: 17 А/В; Total gate charge: 7 нКл; Fall time: 9 нс; Turn-on delay time: 6.5 нс; Rise time: 3.5 нс; Turn-off delay time: 41 нс; Temperature range: -55 ... 150 °C
XP1 = B2B-PH-K-S: PH connector; Manufacturer: JST; Type: Вилка на плату
XP2 = STX-3500-4N: 3.5 jack; Value: *
XS1 = SWD PBS1.27-5: PBS connector; Manufacturer: NONAME; Connector type: Розетка на плату; Number of contacts: 5; Type: Разъем штыревой
XS2 = DM3CS-SF: 1.10mm Pitch TransFlash Memory Card Connector, Hinge Type, Round Corner Top; Manufacturer: Molex; Connector type: Разъем MicroSD на плату; Number of contacts: 11; Type: Разъем
XS3 = 1054500101: Type-C connector; Number of contacts: 24; Connector type: Type-C; Type: Разъем
ZQ1 = NX3225SA-16.000M-STD-CRS-2: QUARTZ CRYSTAL; Manufacturer: NDK; Load capacitance: 8 пФ; Frequency stability: ±15 ppm; Type: Кварцевый резонатор; Temperature range: -40 ... 125 °C